# EAGLE design resistor_board_v1.0 (EAGLE 9.7.0)
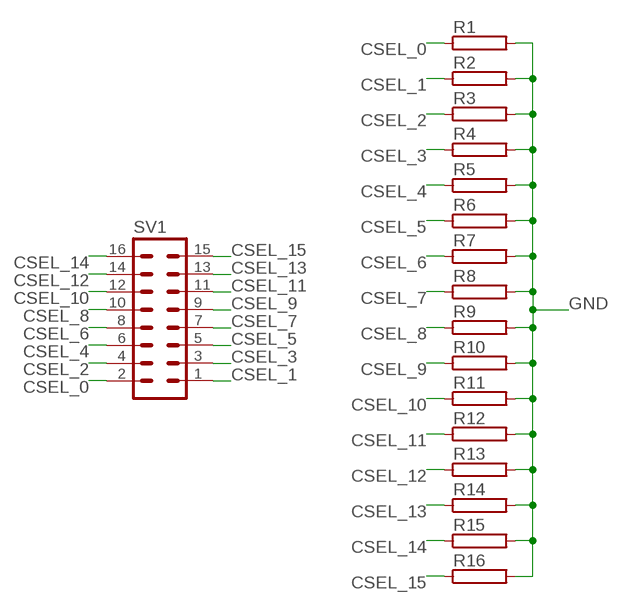
[diagram p0: schematic, sheet 1]

## Parts
R1  RHPS58  [HPS58]
R2  RHPS58  [HPS58]
R3  RHPS58  [HPS58]
R4  RHPS58  [HPS58]
R5  RHPS58  [HPS58]
R6  RHPS58  [HPS58]
R7  RHPS58  [HPS58]
R8  RHPS58  [HPS58]
R9  RHPS58  [HPS58]
R10  RHPS58  [HPS58]
R11  RHPS58  [HPS58]
R12  RHPS58  [HPS58]
R13  RHPS58  [HPS58]
R14  RHPS58  [HPS58]
R15  RHPS58  [HPS58]
R16  RHPS58  [HPS58]
SV1  MA08-2  [MA08-2]

## Nets
CSEL_0: R1.1 SV1.2
CSEL_1: R2.1 SV1.1
CSEL_2: R3.1 SV1.4
CSEL_3: R4.1 SV1.3
CSEL_4: R5.1 SV1.6
CSEL_5: R6.1 SV1.5
CSEL_6: R7.1 SV1.8
CSEL_7: R8.1 SV1.7
CSEL_8: R9.1 SV1.10
CSEL_9: R10.1 SV1.9
CSEL_10: R11.1 SV1.12
CSEL_11: R12.1 SV1.11
CSEL_12: R13.1 SV1.14
CSEL_13: R14.1 SV1.13
CSEL_14: R15.1 SV1.16
CSEL_15: R16.1 SV1.15
GND: R1.2 R2.2 R3.2 R4.2 R5.2 R6.2 R7.2 R8.2 R9.2 R10.2 R11.2 R12.2 R13.2 R14.2 R15.2 R16.2

## Library data of the parts
R1-R16 = resistor-power:R: Power Resitor; OC_FARNELL: unknown; OC_NEWARK: unknown
SV1 = con-lstb:MA08-2: PIN HEADER; OC_FARNELL: unknown; OC_NEWARK: unknown

## Board
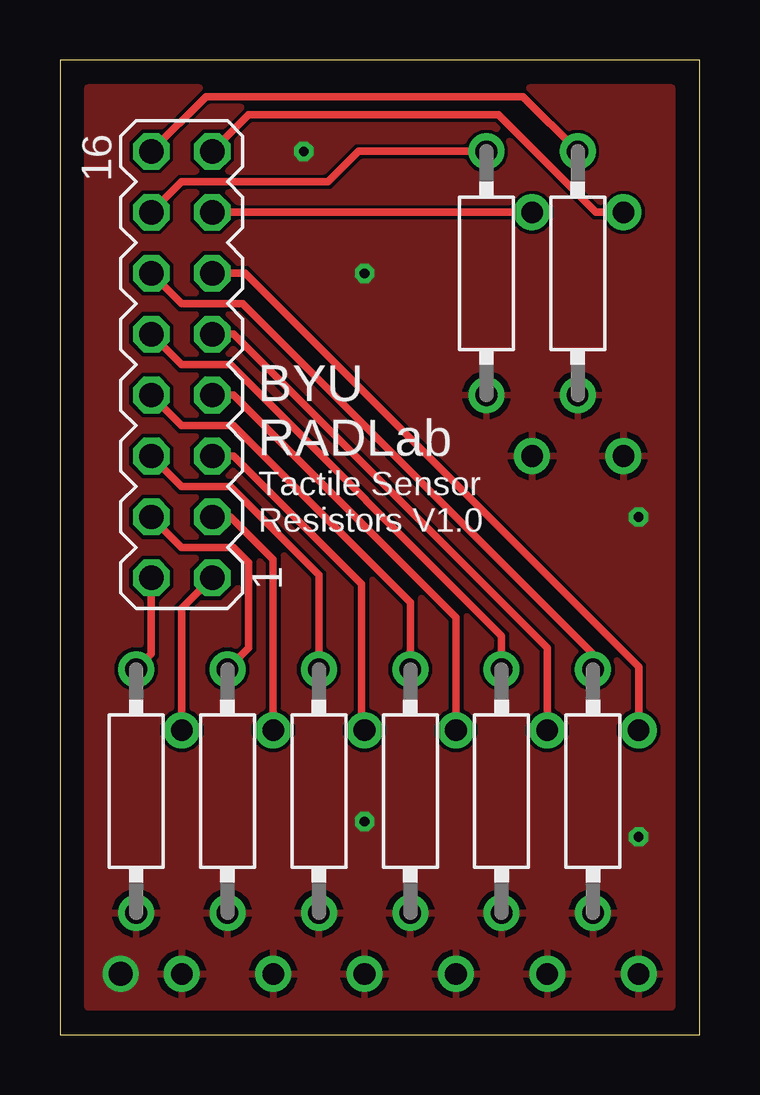
[diagram p1: board, top side]
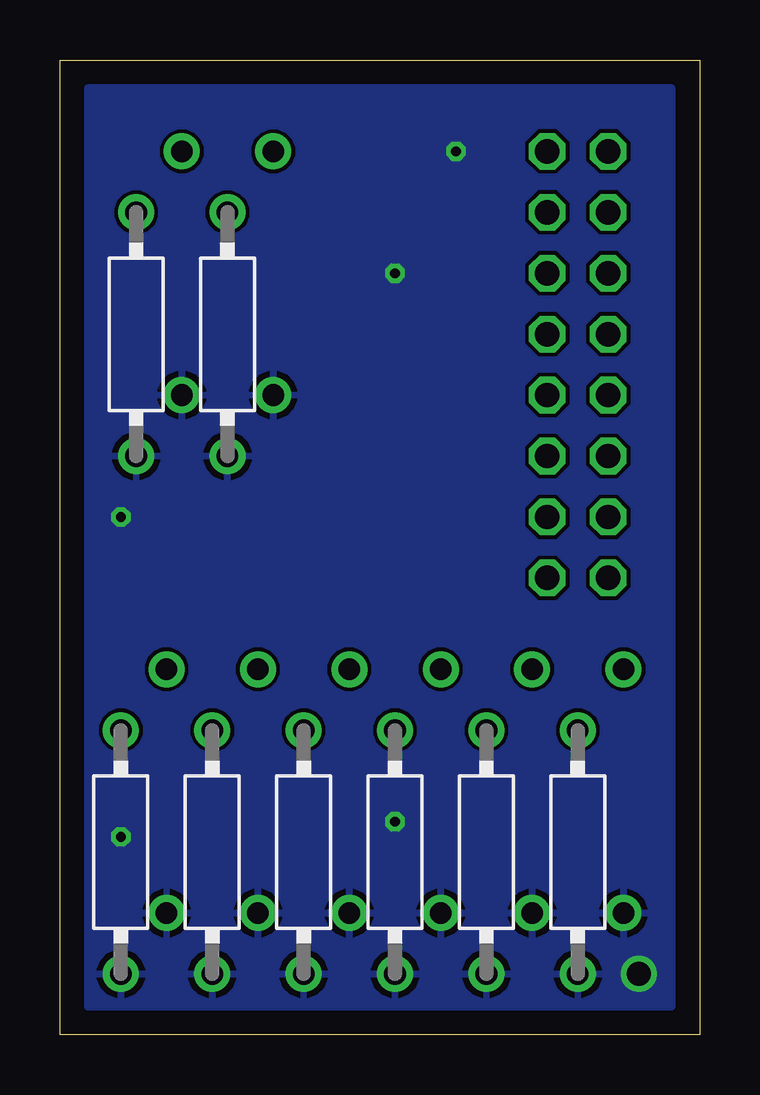
[diagram p2: board, bottom side, seen from below]

Size 26.67 x 40.64 mm. Coordinates in mm from the lower left corner, seen from the top.
Outline: 0,0 26.67,0 26.67,40.64 0,40.64 0,0
Copper layers (1*16): Top / Bottom
Stack-up Default Layer Stack: Top User Defined 0.035mm / Dielectric-1 User Defined 1.5mm / Bottom User Defined 0.035mm
Design rules "default": minimum track width 6mil, minimum drill 0.35mm, track to track 6mil, track to pad 6mil, pad to pad 6mil, via to via 6mil, smd to smd 6mil, copper to edge 40mil, drill to drill 6mil, minimum pad ring 10mil, minimum via ring 8mil, stop-mask expansion 4mil, vias tented up to drill 0mil, thermal gap 10mil

### Footprints (pad centres in the part's own frame; a part is rotated, then mirrored left to right if it is on the bottom)
HPS58 = drill 0.9 pad 1.5: 1 -5.08,0; 2 5.08,0
MA08-2 = drill 1.016 octagon: 1 -8.89,-1.27; 2 -8.89,1.27; 3 -6.35,-1.27; 4 -6.35,1.27; 5 -3.81,-1.27; 6 -3.81,1.27; 7 -1.27,-1.27; 8 -1.27,1.27; 9 1.27,-1.27; 10 1.27,1.27; 11 3.81,-1.27; 12 3.81,1.27; 13 6.35,-1.27; 14 6.35,1.27; 15 8.89,-1.27; 16 8.89,1.27

### Placement (x,y rotation side)
R1  3.17,10.16 270 top
R2  5.08,7.62 270 bottom
R3  6.99,10.16 270 top
R4  8.89,7.62 270 bottom
R5  10.79,10.16 270 top
R6  12.7,7.62 270 bottom
R7  14.61,10.16 270 top
R8  16.51,7.62 270 bottom
R9  18.41,10.16 270 top
R10  20.32,7.62 270 bottom
R11  22.23,10.16 270 top
R12  24.13,7.62 270 bottom
R13  17.78,31.75 270 top
R14  19.68,29.21 270 bottom
R15  21.59,31.75 270 top
R16  23.5,29.21 270 bottom
SV1  5.08,27.94 90 top

### Tracks (layer width: path | path; a pad name or v marks a point on that pad's centre or on a via)
CSEL_0
  Top 0.305: SV1.2 3.81,15.88 R1.1
CSEL_1
  Top 0.305: SV1.1 5.08,17.78 R2.1
CSEL_2
  Top 0.305: SV1.4 5.08,20.32 7.24,20.32 7.87,19.68 7.87,16.13 R3.1
CSEL_3
  Top 0.305: SV1.3 7.11,21.59 8.89,19.81 R4.1
CSEL_4
  Top 0.305: SV1.6 5.08,22.86 7.11,22.86 10.79,19.18 R5.1
CSEL_5
  Top 0.305: SV1.5 7.24,24.13 12.57,18.8 12.57,12.83 R6.1
CSEL_6
  Top 0.305: SV1.8 5.08,25.4 7.24,25.4 14.61,18.03 R7.1
CSEL_7
  Top 0.305: SV1.7 7.24,26.67 16.51,17.4 R8.1 | R8.1
CSEL_8
  Top 0.305: SV1.10 5.08,27.94 7.11,27.94 18.41,16.64 R9.1
CSEL_9
  Top 0.305: R10.1 20.32,16.13 7.24,29.21 SV1.9
CSEL_10
  Top 0.305: SV1.12 5.08,30.48 7.62,30.48 22.23,15.88 R11.1
CSEL_11
  Top 0.305: SV1.11 7.71,31.75 24.13,15.34 R12.1
CSEL_12
  Top 0.305: R13.1 12.45,36.83 11.18,35.56 5.08,35.56 SV1.14
CSEL_13
  Top 0.305: SV1.13 R14.1
CSEL_14
  Top 0.305: SV1.16 6.1,39.12 19.3,39.12 R15.1
CSEL_15
  Top 0.305: SV1.15 7.87,38.35 18.29,38.35 22.35,34.29 R16.1
GND  (via drill 0.4, 1)
  other vias: 2.54,2.54 12.7,31.75 24.13,21.59 12.7,8.89 10.16,36.83 24.13,8.26
  pour Top: 28.09,42.06 -1.42,42.06 -1.42,-1.42 28.09,-1.42
  pour Bottom: 28.09,42.06 -1.17,42.06 -1.17,-1.42 28.09,-1.42

### Text on the board
tNames: BYU / RADLab | Tactile Sensor / Resistors V1.0